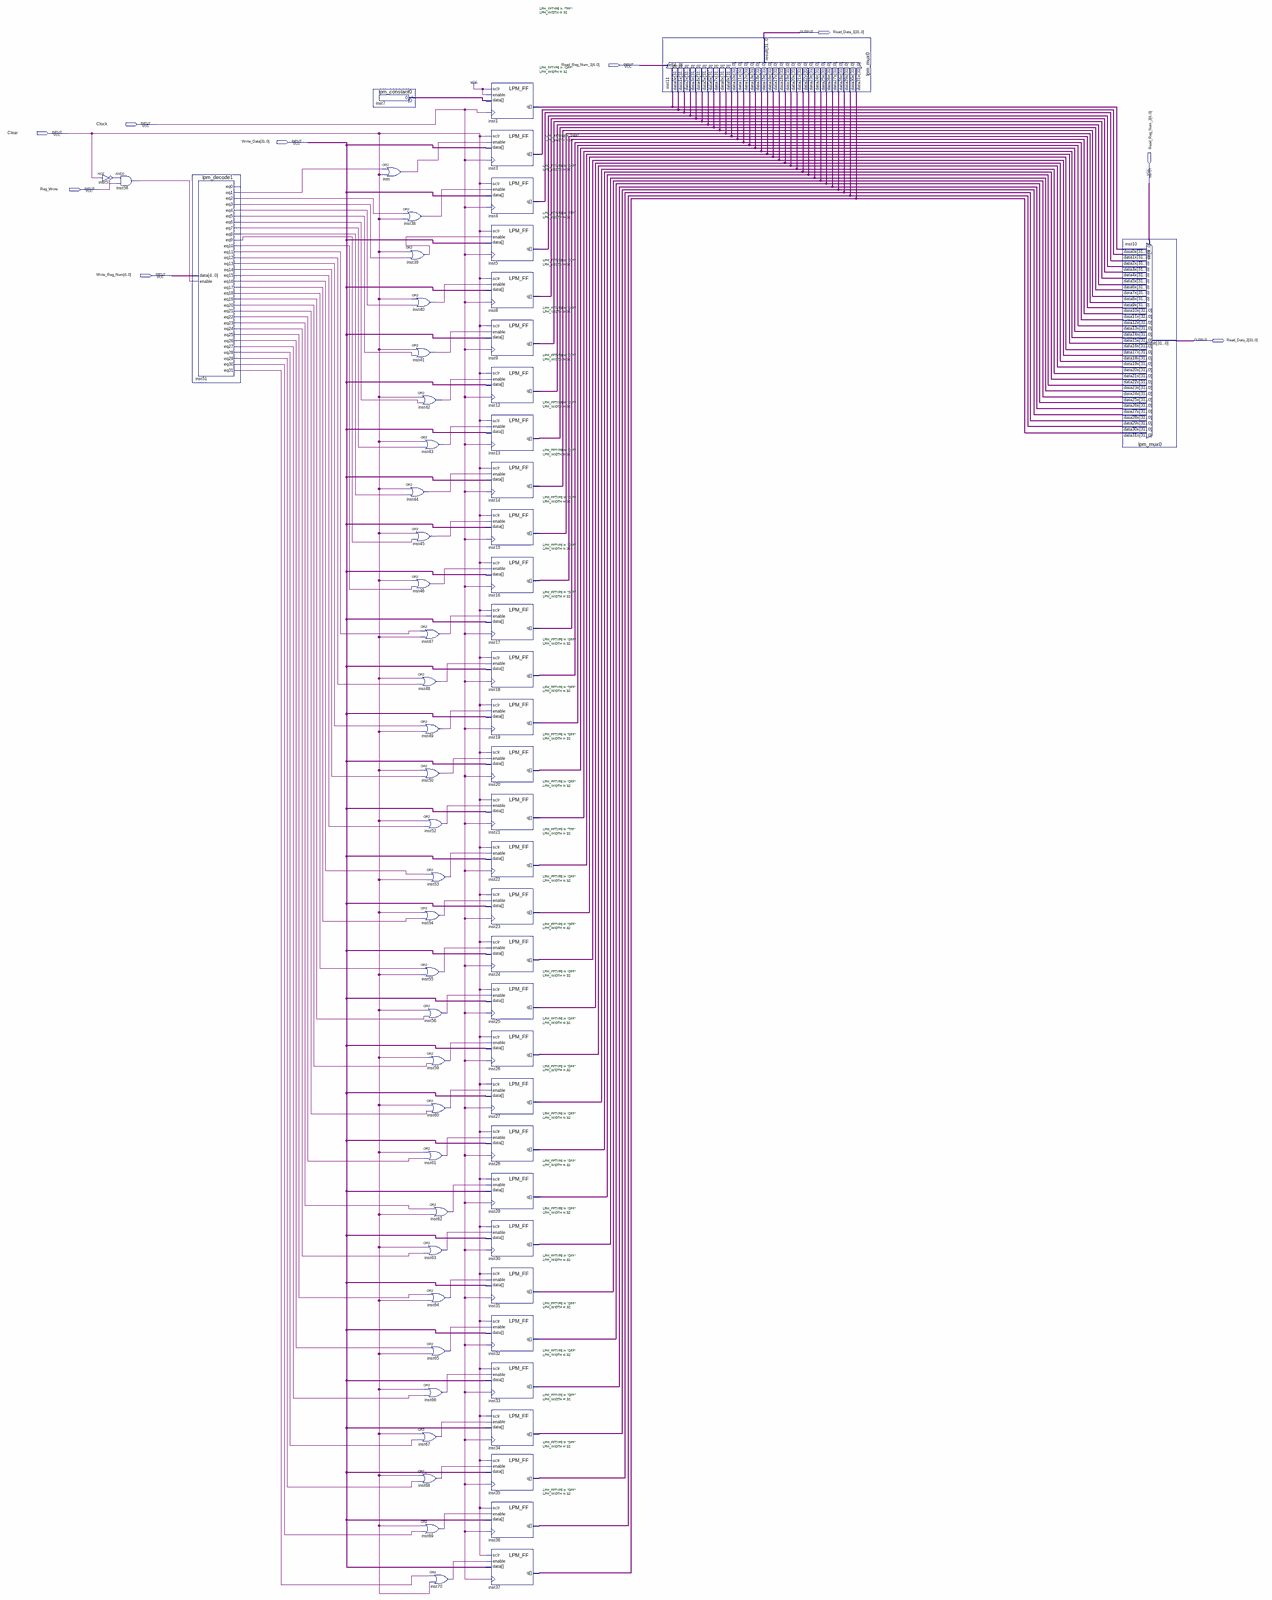
[diagram p0: schematic sheet, whole]
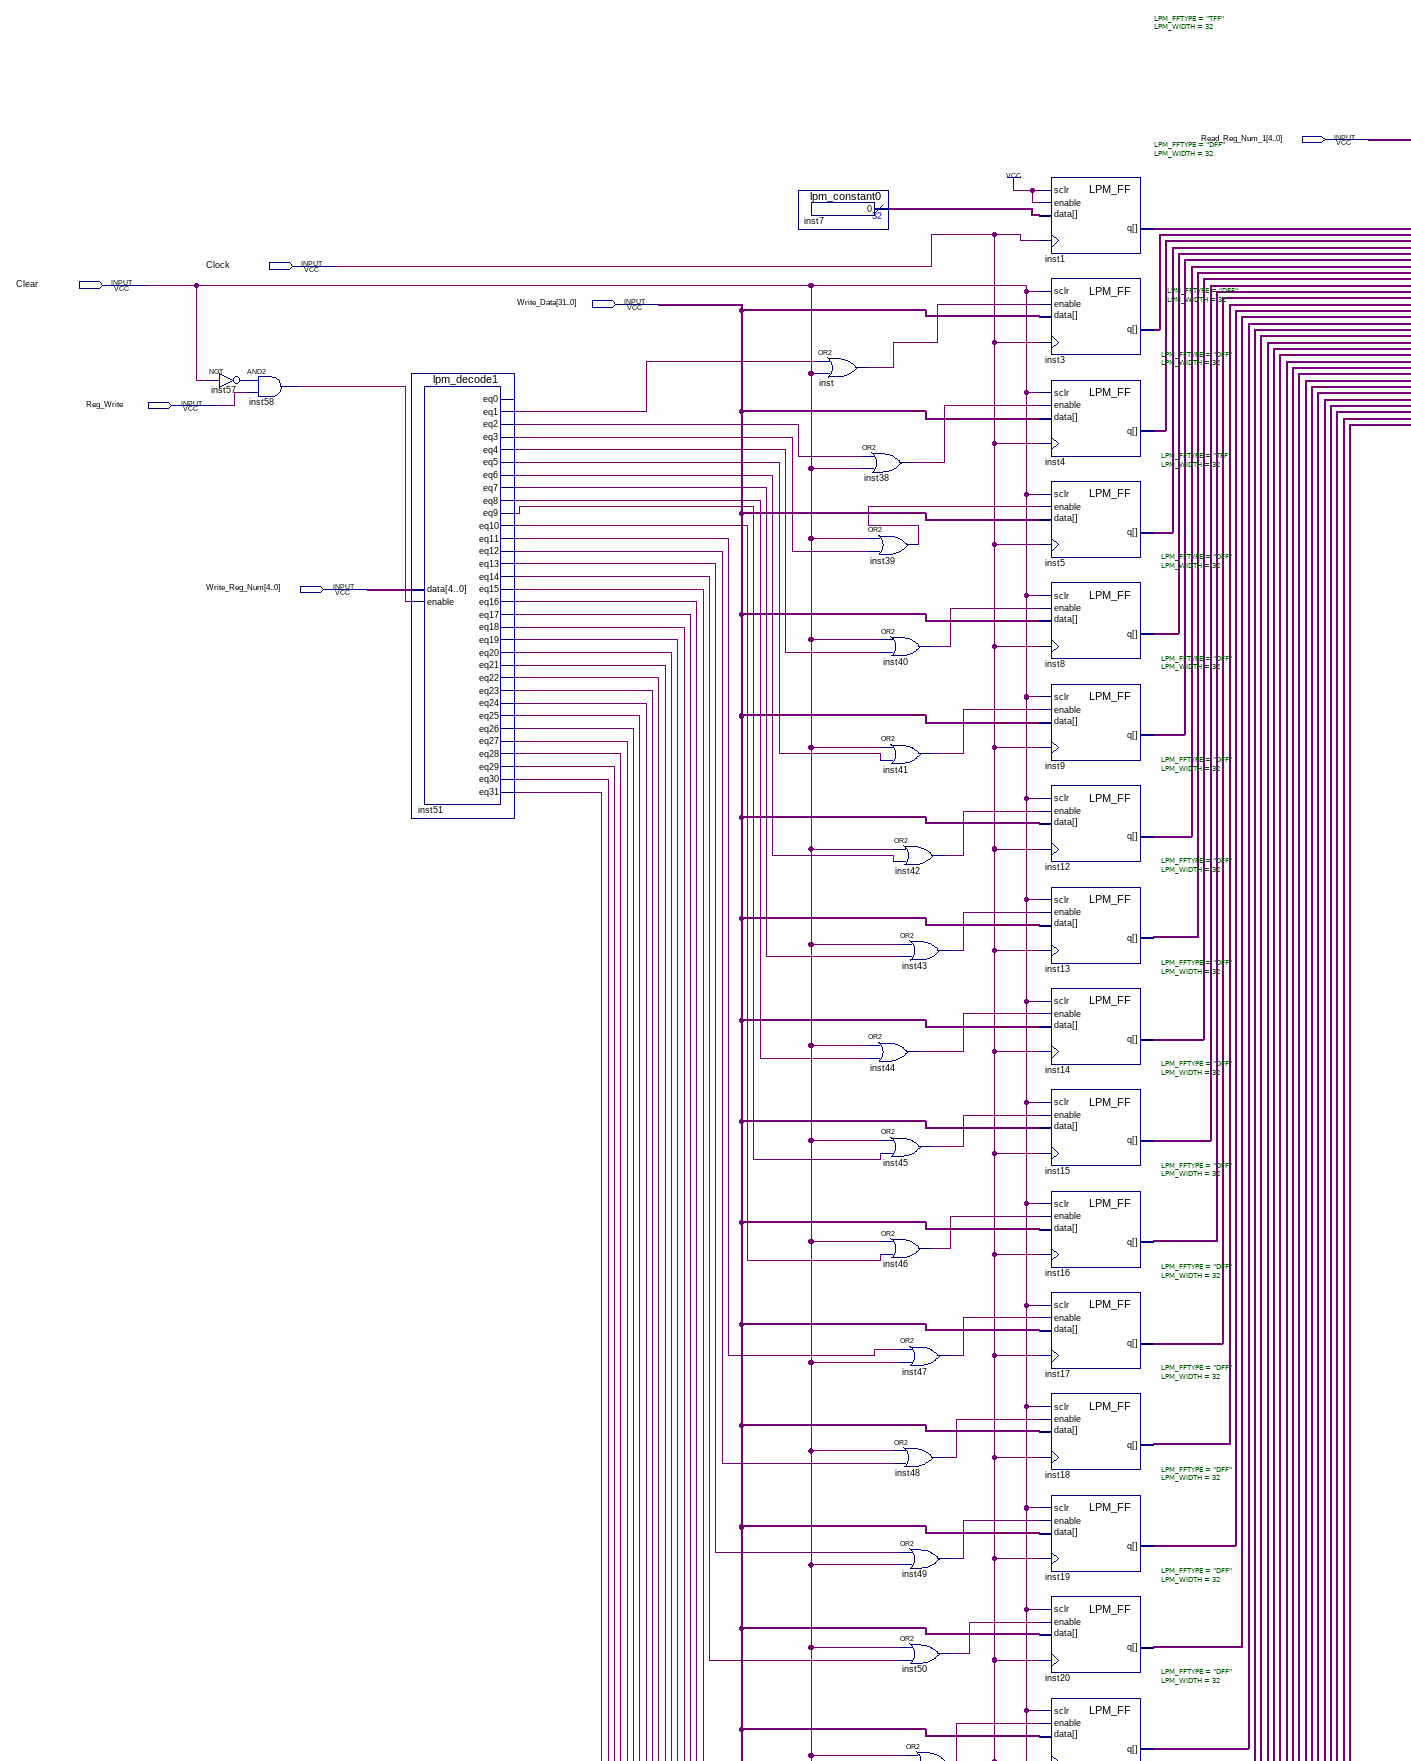
[diagram p1: schematic sheet, upper left part]
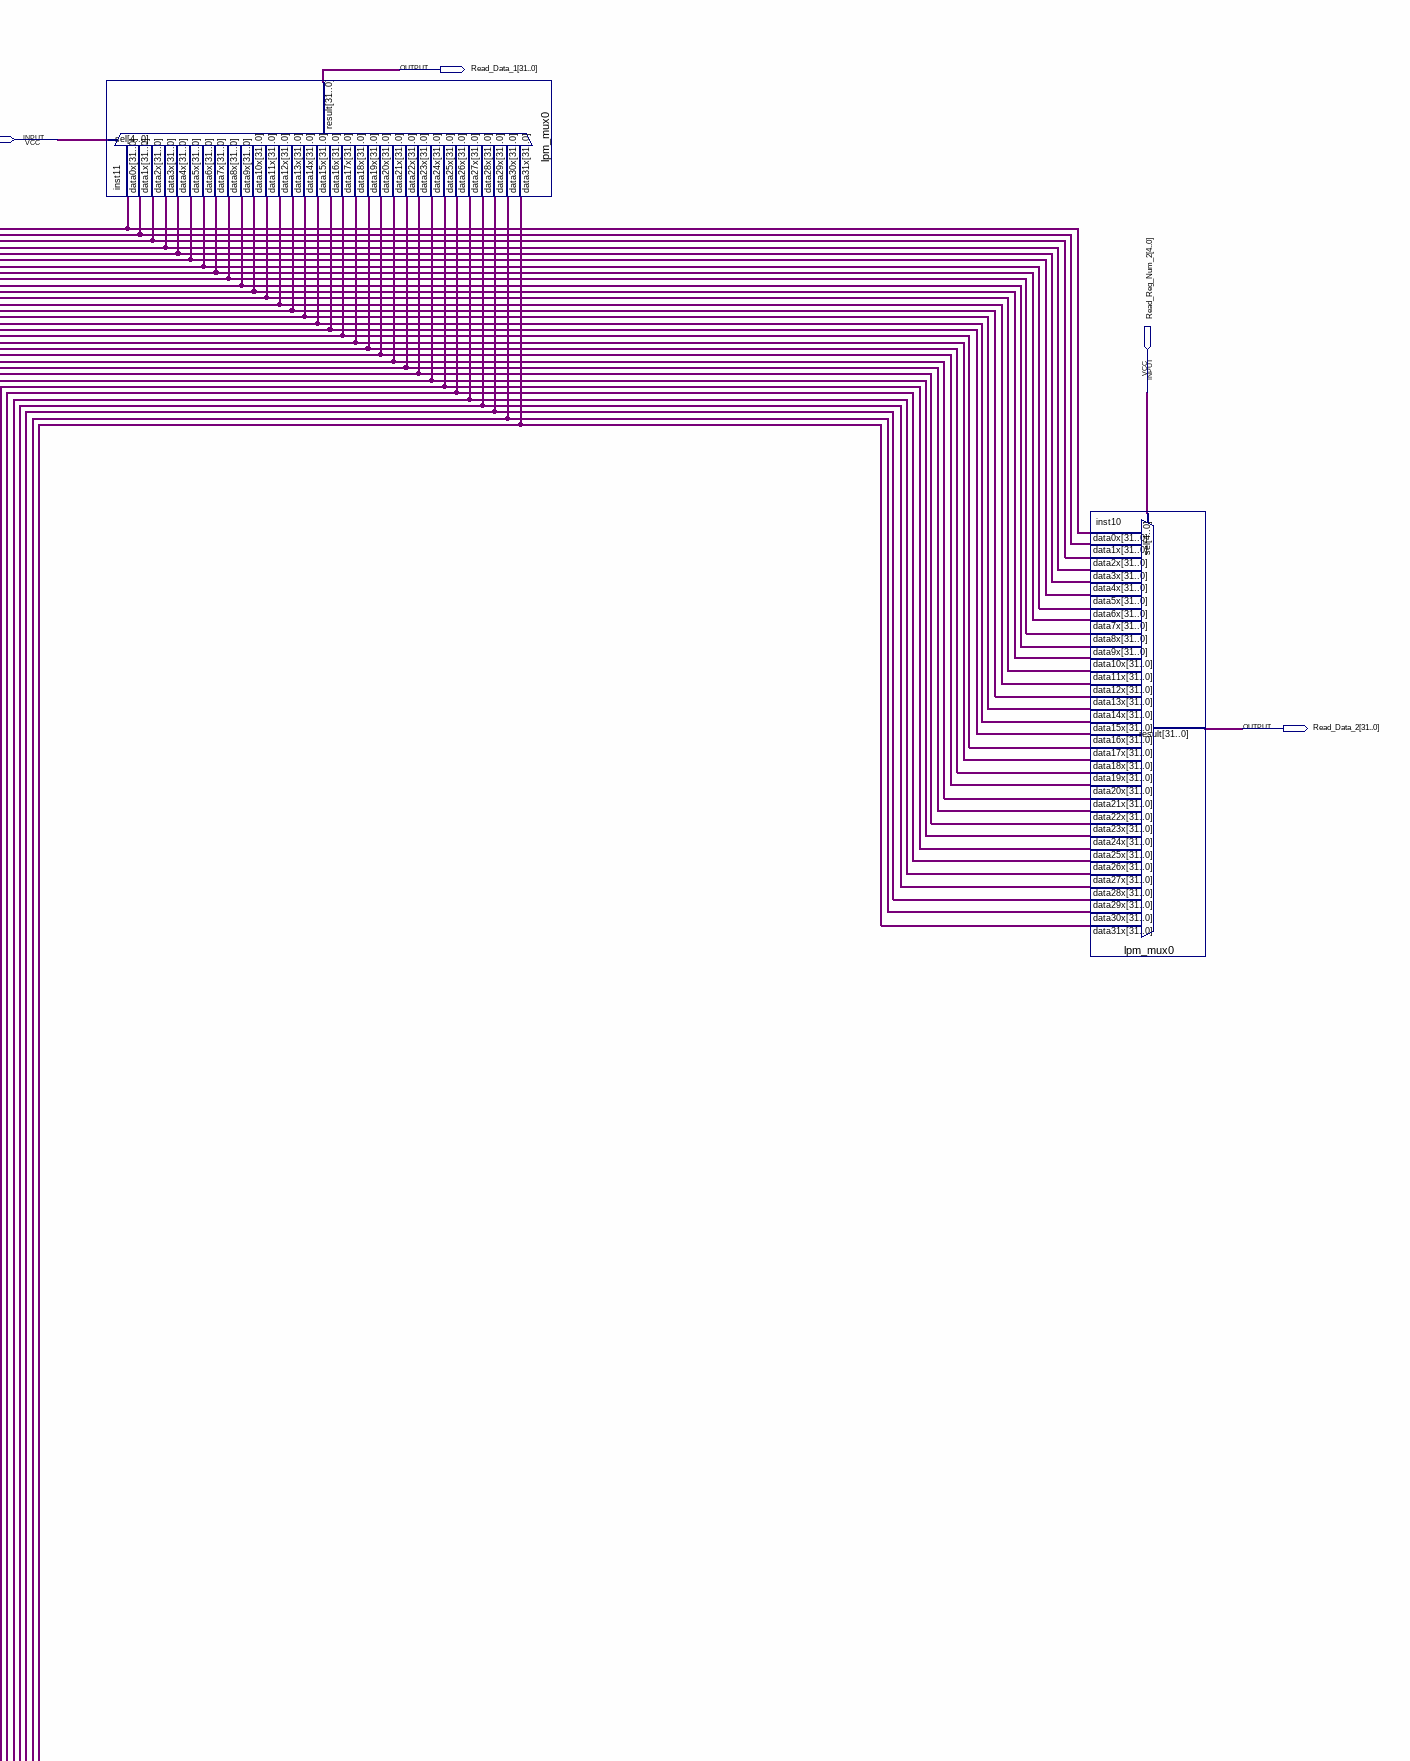
[diagram p2: schematic sheet, upper right part]
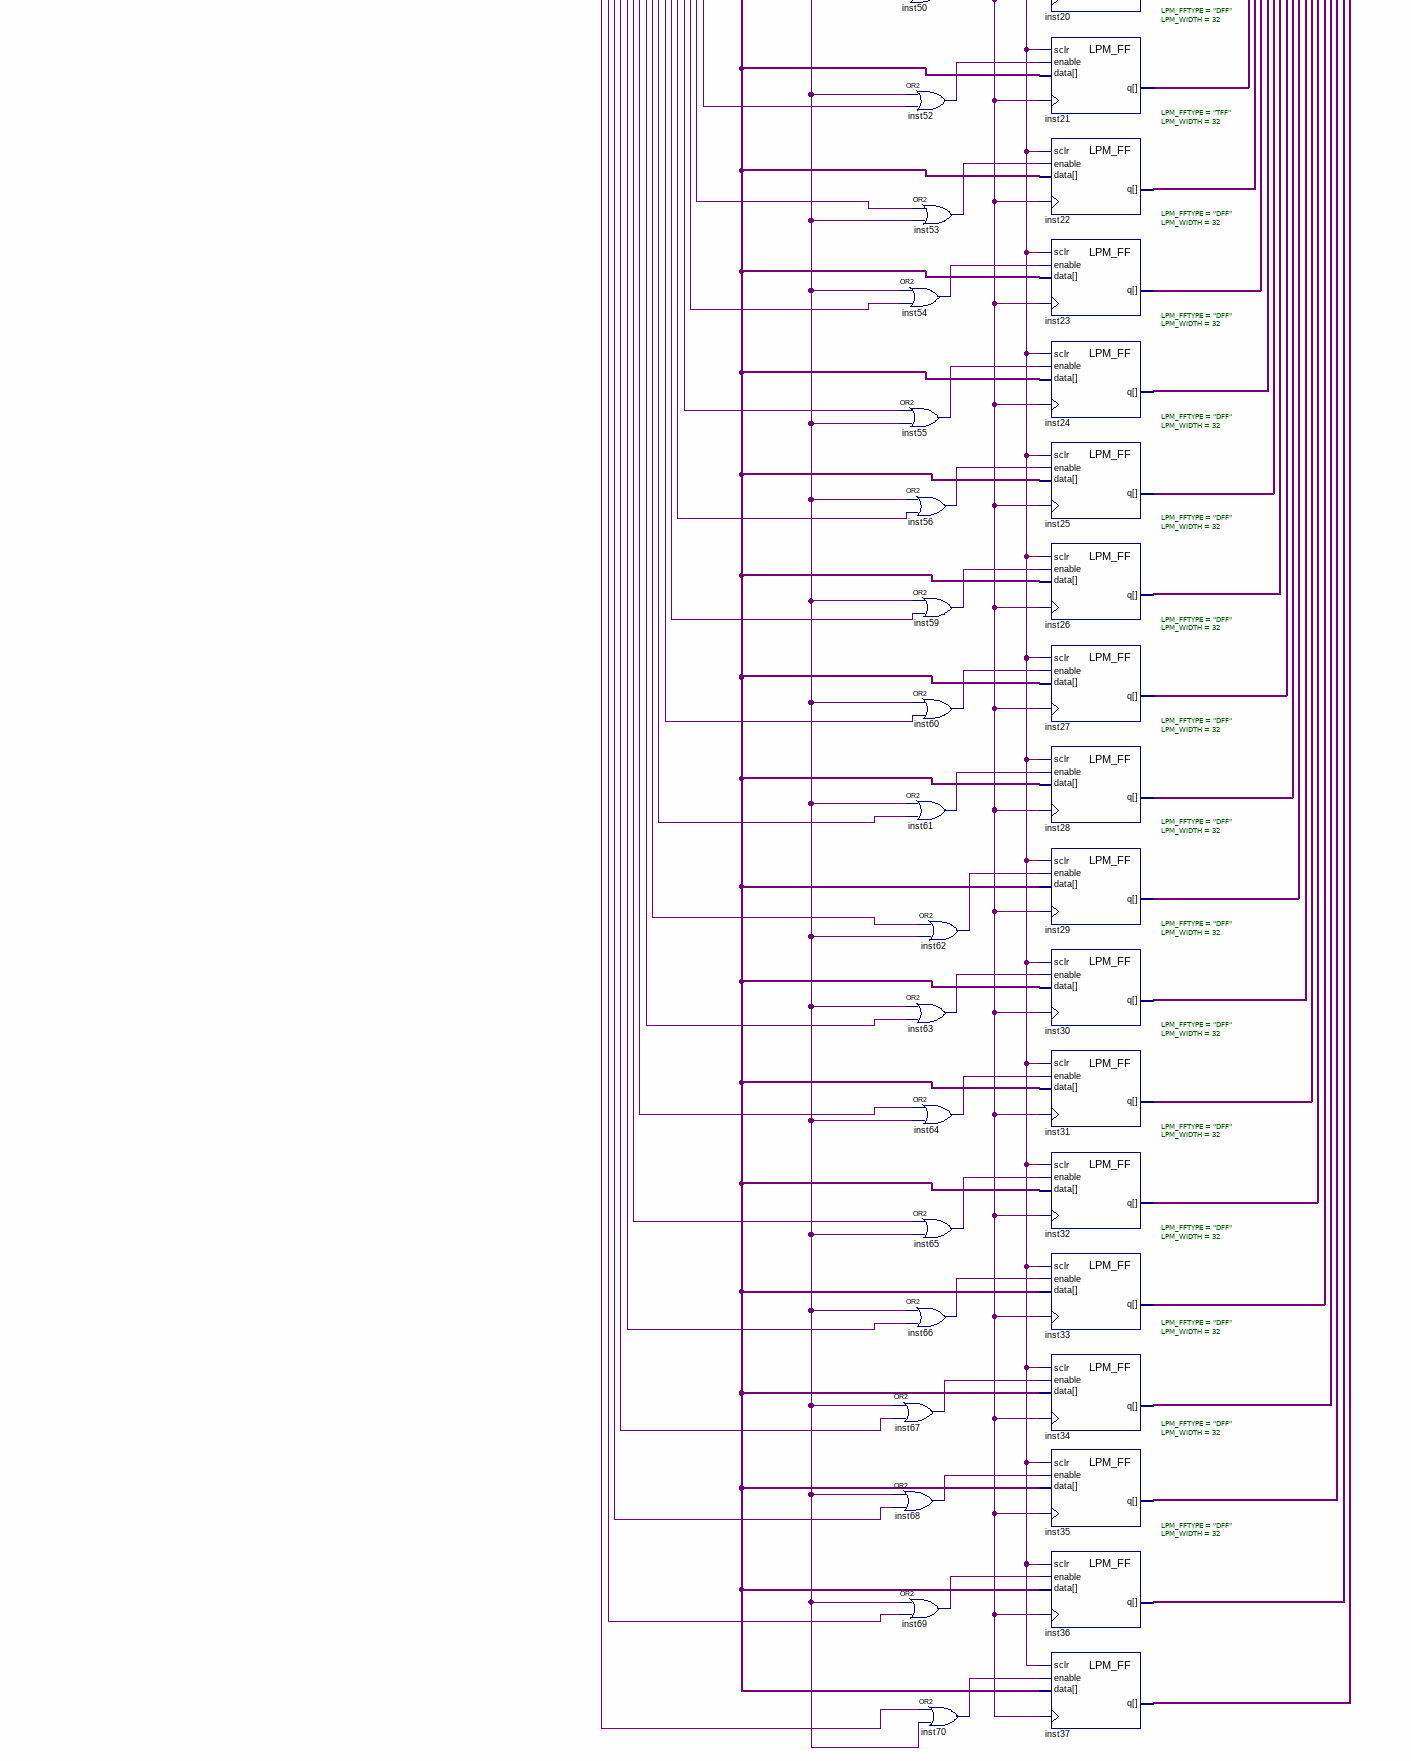
[diagram p3: schematic sheet, lower left part]
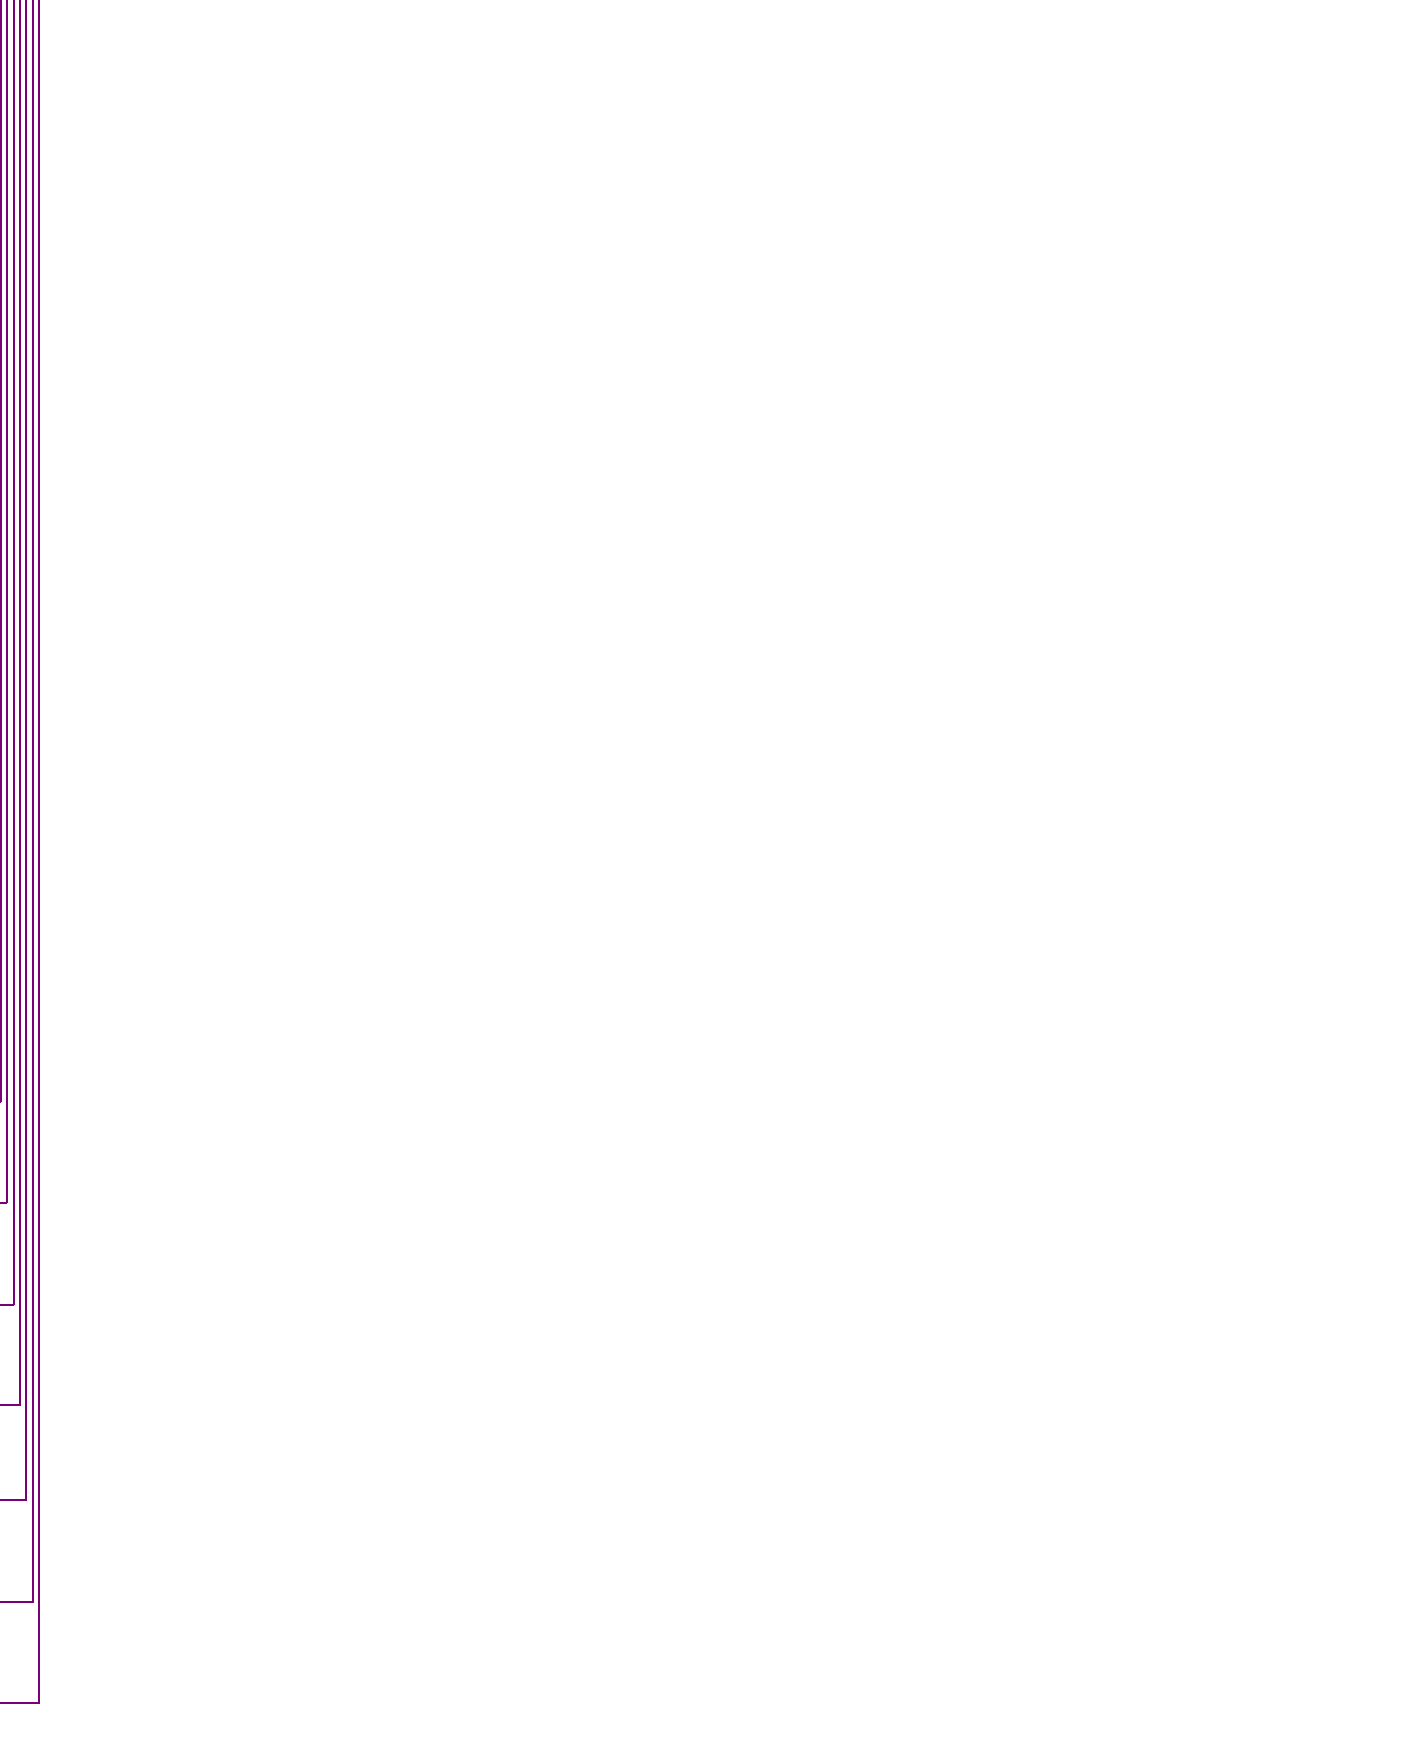
[diagram p4: schematic sheet, lower right part]
// Quartus schematic HW7_USING_FF.bdf as structural Verilog: 69 symbols, 9 pins
module HW7_USING_FF (
  input  [4:0] Read_Reg_Num_1,
  input  Clock,
  input  Clear,
  input  [31:0] Write_Data,
  input  [4:0] Read_Reg_Num_2,
  input  Reg_Write,
  input  [4:0] Write_Reg_Num,
  output [31:0] Read_Data_1,
  output [31:0] Read_Data_2
);

  wire inst38_out, inst39_out, inst40_out, inst41_out, inst42_out, inst43_out, inst44_out, inst45_out,
       inst46_out, inst47_out, inst48_out, inst49_out, inst50_out, inst51_eq1, inst51_eq2, inst51_eq3,
       inst51_eq4, inst51_eq5, inst51_eq6, inst51_eq7, inst51_eq8, inst51_eq9, inst51_eq10, inst51_eq11,
       inst51_eq12, inst51_eq13, inst51_eq14, inst51_eq15, inst51_eq16, inst51_eq17, inst51_eq18,
       inst51_eq19, inst51_eq20, inst51_eq21, inst51_eq22, inst51_eq23, inst51_eq24, inst51_eq25,
       inst51_eq26, inst51_eq27, inst51_eq28, inst51_eq29, inst51_eq30, inst51_eq31, inst52_out, inst53_out,
       inst54_out, inst55_out, inst56_out, inst57_out, inst58_out, inst59_out, inst60_out, inst61_out,
       inst62_out, inst63_out, inst64_out, inst65_out, inst66_out, inst67_out, inst68_out, inst69_out,
       inst70_out, inst_out;
  wire [31:0] inst1_q, inst3_q, inst4_q, inst5_q, inst7_result, inst8_q, inst9_q, inst12_q, inst13_q,
       inst14_q, inst15_q, inst16_q, inst17_q, inst18_q, inst19_q, inst20_q, inst21_q, inst22_q, inst23_q,
       inst24_q, inst25_q, inst26_q, inst27_q, inst28_q, inst29_q, inst30_q, inst31_q, inst32_q, inst33_q,
       inst34_q, inst35_q, inst36_q, inst37_q;

  not inst57 (inst57_out, Clear);
  and inst58 (inst58_out, inst57_out, Reg_Write);
  lpm_decode1 inst51 (
    .data(Write_Reg_Num), .enable(inst58_out), .eq1(inst51_eq1), .eq10(inst51_eq10), .eq11(inst51_eq11),
    .eq12(inst51_eq12), .eq13(inst51_eq13), .eq14(inst51_eq14), .eq15(inst51_eq15), .eq16(inst51_eq16),
    .eq17(inst51_eq17), .eq18(inst51_eq18), .eq19(inst51_eq19), .eq2(inst51_eq2), .eq20(inst51_eq20),
    .eq21(inst51_eq21), .eq22(inst51_eq22), .eq23(inst51_eq23), .eq24(inst51_eq24), .eq25(inst51_eq25),
    .eq26(inst51_eq26), .eq27(inst51_eq27), .eq28(inst51_eq28), .eq29(inst51_eq29), .eq3(inst51_eq3),
    .eq30(inst51_eq30), .eq31(inst51_eq31), .eq4(inst51_eq4), .eq5(inst51_eq5), .eq6(inst51_eq6),
    .eq7(inst51_eq7), .eq8(inst51_eq8), .eq9(inst51_eq9));  // open: eq0
  lpm_constant0 inst7 (.result(inst7_result));
  or inst (inst_out, inst51_eq1, Clear);
  or inst38 (inst38_out, inst51_eq2, Clear);
  or inst39 (inst39_out, Clear, inst51_eq3);
  or inst40 (inst40_out, Clear, inst51_eq4);
  or inst41 (inst41_out, Clear, inst51_eq5);
  or inst42 (inst42_out, Clear, inst51_eq6);
  or inst43 (inst43_out, Clear, inst51_eq7);
  or inst44 (inst44_out, Clear, inst51_eq8);
  or inst45 (inst45_out, Clear, inst51_eq9);
  or inst46 (inst46_out, Clear, inst51_eq10);
  or inst47 (inst47_out, inst51_eq11, Clear);
  or inst48 (inst48_out, Clear, inst51_eq12);
  or inst49 (inst49_out, inst51_eq13, Clear);
  or inst50 (inst50_out, Clear, inst51_eq14);
  or inst52 (inst52_out, Clear, inst51_eq15);
  or inst53 (inst53_out, inst51_eq16, Clear);
  or inst54 (inst54_out, Clear, inst51_eq17);
  or inst55 (inst55_out, inst51_eq18, Clear);
  or inst56 (inst56_out, Clear, inst51_eq19);
  or inst59 (inst59_out, Clear, inst51_eq20);
  or inst60 (inst60_out, Clear, inst51_eq21);
  or inst61 (inst61_out, Clear, inst51_eq22);
  or inst63 (inst63_out, Clear, inst51_eq24);
  or inst64 (inst64_out, inst51_eq25, Clear);
  or inst65 (inst65_out, inst51_eq26, Clear);
  or inst66 (inst66_out, Clear, inst51_eq27);
  or inst67 (inst67_out, Clear, inst51_eq28);
  or inst68 (inst68_out, Clear, inst51_eq29);
  or inst69 (inst69_out, Clear, inst51_eq30);
  or inst62 (inst62_out, inst51_eq23, Clear);
  or inst70 (inst70_out, inst51_eq31, Clear);
  LPM_FF #(.LPM_FFTYPE("TFF"), .LPM_WIDTH(32)) inst1 (
    .clock(Clock), .sclr(1'b1), .data(inst7_result), .enable(1'b1), .q(inst1_q));
  LPM_FF #(.LPM_FFTYPE("DFF"), .LPM_WIDTH(32)) inst3 (
    .clock(Clock), .sclr(Clear), .data(Write_Data), .enable(inst_out), .q(inst3_q));
  LPM_FF #(.LPM_FFTYPE("DFF"), .LPM_WIDTH(32)) inst4 (
    .clock(Clock), .sclr(Clear), .data(Write_Data), .enable(inst38_out), .q(inst4_q));
  LPM_FF #(.LPM_FFTYPE("DFF"), .LPM_WIDTH(32)) inst5 (
    .clock(Clock), .sclr(Clear), .data(Write_Data), .enable(inst39_out), .q(inst5_q));
  LPM_FF #(.LPM_FFTYPE("TFF"), .LPM_WIDTH(32)) inst8 (
    .clock(Clock), .sclr(Clear), .data(Write_Data), .enable(inst40_out), .q(inst8_q));
  LPM_FF #(.LPM_FFTYPE("DFF"), .LPM_WIDTH(32)) inst9 (
    .clock(Clock), .sclr(Clear), .data(Write_Data), .enable(inst41_out), .q(inst9_q));
  LPM_FF #(.LPM_FFTYPE("DFF"), .LPM_WIDTH(32)) inst12 (
    .clock(Clock), .sclr(Clear), .data(Write_Data), .enable(inst42_out), .q(inst12_q));
  LPM_FF #(.LPM_FFTYPE("DFF"), .LPM_WIDTH(32)) inst13 (
    .clock(Clock), .sclr(Clear), .data(Write_Data), .enable(inst43_out), .q(inst13_q));
  LPM_FF #(.LPM_FFTYPE("DFF"), .LPM_WIDTH(32)) inst14 (
    .clock(Clock), .sclr(Clear), .data(Write_Data), .enable(inst44_out), .q(inst14_q));
  LPM_FF #(.LPM_FFTYPE("DFF"), .LPM_WIDTH(32)) inst15 (
    .clock(Clock), .sclr(Clear), .data(Write_Data), .enable(inst45_out), .q(inst15_q));
  LPM_FF #(.LPM_FFTYPE("DFF"), .LPM_WIDTH(32)) inst16 (
    .clock(Clock), .sclr(Clear), .data(Write_Data), .enable(inst46_out), .q(inst16_q));
  LPM_FF #(.LPM_FFTYPE("DFF"), .LPM_WIDTH(32)) inst17 (
    .clock(Clock), .sclr(Clear), .data(Write_Data), .enable(inst47_out), .q(inst17_q));
  LPM_FF #(.LPM_FFTYPE("DFF"), .LPM_WIDTH(32)) inst18 (
    .clock(Clock), .sclr(Clear), .data(Write_Data), .enable(inst48_out), .q(inst18_q));
  LPM_FF #(.LPM_FFTYPE("DFF"), .LPM_WIDTH(32)) inst19 (
    .clock(Clock), .sclr(Clear), .data(Write_Data), .enable(inst49_out), .q(inst19_q));
  LPM_FF #(.LPM_FFTYPE("DFF"), .LPM_WIDTH(32)) inst20 (
    .clock(Clock), .sclr(Clear), .data(Write_Data), .enable(inst50_out), .q(inst20_q));
  LPM_FF #(.LPM_FFTYPE("DFF"), .LPM_WIDTH(32)) inst21 (
    .clock(Clock), .sclr(Clear), .data(Write_Data), .enable(inst52_out), .q(inst21_q));
  LPM_FF #(.LPM_FFTYPE("DFF"), .LPM_WIDTH(32)) inst22 (
    .clock(Clock), .sclr(Clear), .data(Write_Data), .enable(inst53_out), .q(inst22_q));
  LPM_FF #(.LPM_FFTYPE("TFF"), .LPM_WIDTH(32)) inst23 (
    .clock(Clock), .sclr(Clear), .data(Write_Data), .enable(inst54_out), .q(inst23_q));
  LPM_FF #(.LPM_FFTYPE("DFF"), .LPM_WIDTH(32)) inst24 (
    .clock(Clock), .sclr(Clear), .data(Write_Data), .enable(inst55_out), .q(inst24_q));
  LPM_FF #(.LPM_FFTYPE("DFF"), .LPM_WIDTH(32)) inst25 (
    .clock(Clock), .sclr(Clear), .data(Write_Data), .enable(inst56_out), .q(inst25_q));
  LPM_FF #(.LPM_FFTYPE("DFF"), .LPM_WIDTH(32)) inst26 (
    .clock(Clock), .sclr(Clear), .data(Write_Data), .enable(inst59_out), .q(inst26_q));
  LPM_FF #(.LPM_FFTYPE("DFF"), .LPM_WIDTH(32)) inst27 (
    .clock(Clock), .sclr(Clear), .data(Write_Data), .enable(inst60_out), .q(inst27_q));
  LPM_FF #(.LPM_FFTYPE("DFF"), .LPM_WIDTH(32)) inst28 (
    .clock(Clock), .sclr(Clear), .data(Write_Data), .enable(inst61_out), .q(inst28_q));
  LPM_FF #(.LPM_FFTYPE("DFF"), .LPM_WIDTH(32)) inst29 (
    .clock(Clock), .sclr(Clear), .data(Write_Data), .enable(inst62_out), .q(inst29_q));
  LPM_FF #(.LPM_FFTYPE("DFF"), .LPM_WIDTH(32)) inst30 (
    .clock(Clock), .sclr(Clear), .data(Write_Data), .enable(inst63_out), .q(inst30_q));
  LPM_FF #(.LPM_FFTYPE("DFF"), .LPM_WIDTH(32)) inst31 (
    .clock(Clock), .sclr(Clear), .data(Write_Data), .enable(inst64_out), .q(inst31_q));
  LPM_FF #(.LPM_FFTYPE("DFF"), .LPM_WIDTH(32)) inst32 (
    .clock(Clock), .sclr(Clear), .data(Write_Data), .enable(inst65_out), .q(inst32_q));
  LPM_FF #(.LPM_FFTYPE("DFF"), .LPM_WIDTH(32)) inst33 (
    .clock(Clock), .sclr(Clear), .data(Write_Data), .enable(inst66_out), .q(inst33_q));
  LPM_FF #(.LPM_FFTYPE("DFF"), .LPM_WIDTH(32)) inst34 (
    .clock(Clock), .sclr(Clear), .data(Write_Data), .enable(inst67_out), .q(inst34_q));
  LPM_FF #(.LPM_FFTYPE("DFF"), .LPM_WIDTH(32)) inst35 (
    .clock(Clock), .sclr(Clear), .data(Write_Data), .enable(inst68_out), .q(inst35_q));
  LPM_FF #(.LPM_FFTYPE("DFF"), .LPM_WIDTH(32)) inst36 (
    .clock(Clock), .sclr(Clear), .data(Write_Data), .enable(inst69_out), .q(inst36_q));
  LPM_FF #(.LPM_FFTYPE("DFF"), .LPM_WIDTH(32)) inst37 (
    .clock(Clock), .sclr(Clear), .data(Write_Data), .enable(inst70_out), .q(inst37_q));
  lpm_mux0 inst11 (
    .data31x(inst37_q), .data30x(inst36_q), .data29x(inst35_q), .data28x(inst34_q), .data27x(inst33_q),
    .data26x(inst32_q), .data25x(inst31_q), .data24x(inst30_q), .data23x(inst29_q), .data22x(inst28_q),
    .data21x(inst27_q), .data20x(inst26_q), .data19x(inst25_q), .data18x(inst24_q), .data17x(inst23_q),
    .data16x(inst22_q), .data15x(inst21_q), .data14x(inst20_q), .data13x(inst19_q), .data12x(inst18_q),
    .data11x(inst17_q), .data10x(inst16_q), .data9x(inst15_q), .data8x(inst14_q), .data7x(inst13_q),
    .data6x(inst12_q), .data5x(inst9_q), .data4x(inst8_q), .data3x(inst5_q), .data2x(inst4_q),
    .data1x(inst3_q), .data0x(inst1_q), .sel(Read_Reg_Num_1), .result(Read_Data_1));
  lpm_mux0 inst10 (
    .data31x(inst37_q), .data30x(inst36_q), .data29x(inst35_q), .data28x(inst34_q), .data27x(inst33_q),
    .data26x(inst32_q), .data25x(inst31_q), .data24x(inst30_q), .data23x(inst29_q), .data22x(inst28_q),
    .data21x(inst27_q), .data20x(inst26_q), .data19x(inst25_q), .data18x(inst24_q), .data17x(inst23_q),
    .data16x(inst22_q), .data15x(inst21_q), .data14x(inst20_q), .data13x(inst19_q), .data12x(inst18_q),
    .data11x(inst17_q), .data10x(inst16_q), .data9x(inst15_q), .data8x(inst14_q), .data7x(inst13_q),
    .data6x(inst12_q), .data5x(inst9_q), .data4x(inst8_q), .data3x(inst5_q), .data2x(inst4_q),
    .data1x(inst3_q), .data0x(inst1_q), .sel(Read_Reg_Num_2), .result(Read_Data_2));
endmodule
